# Altium schematic sheet 录音（ISD4004）.SchDoc
size A4
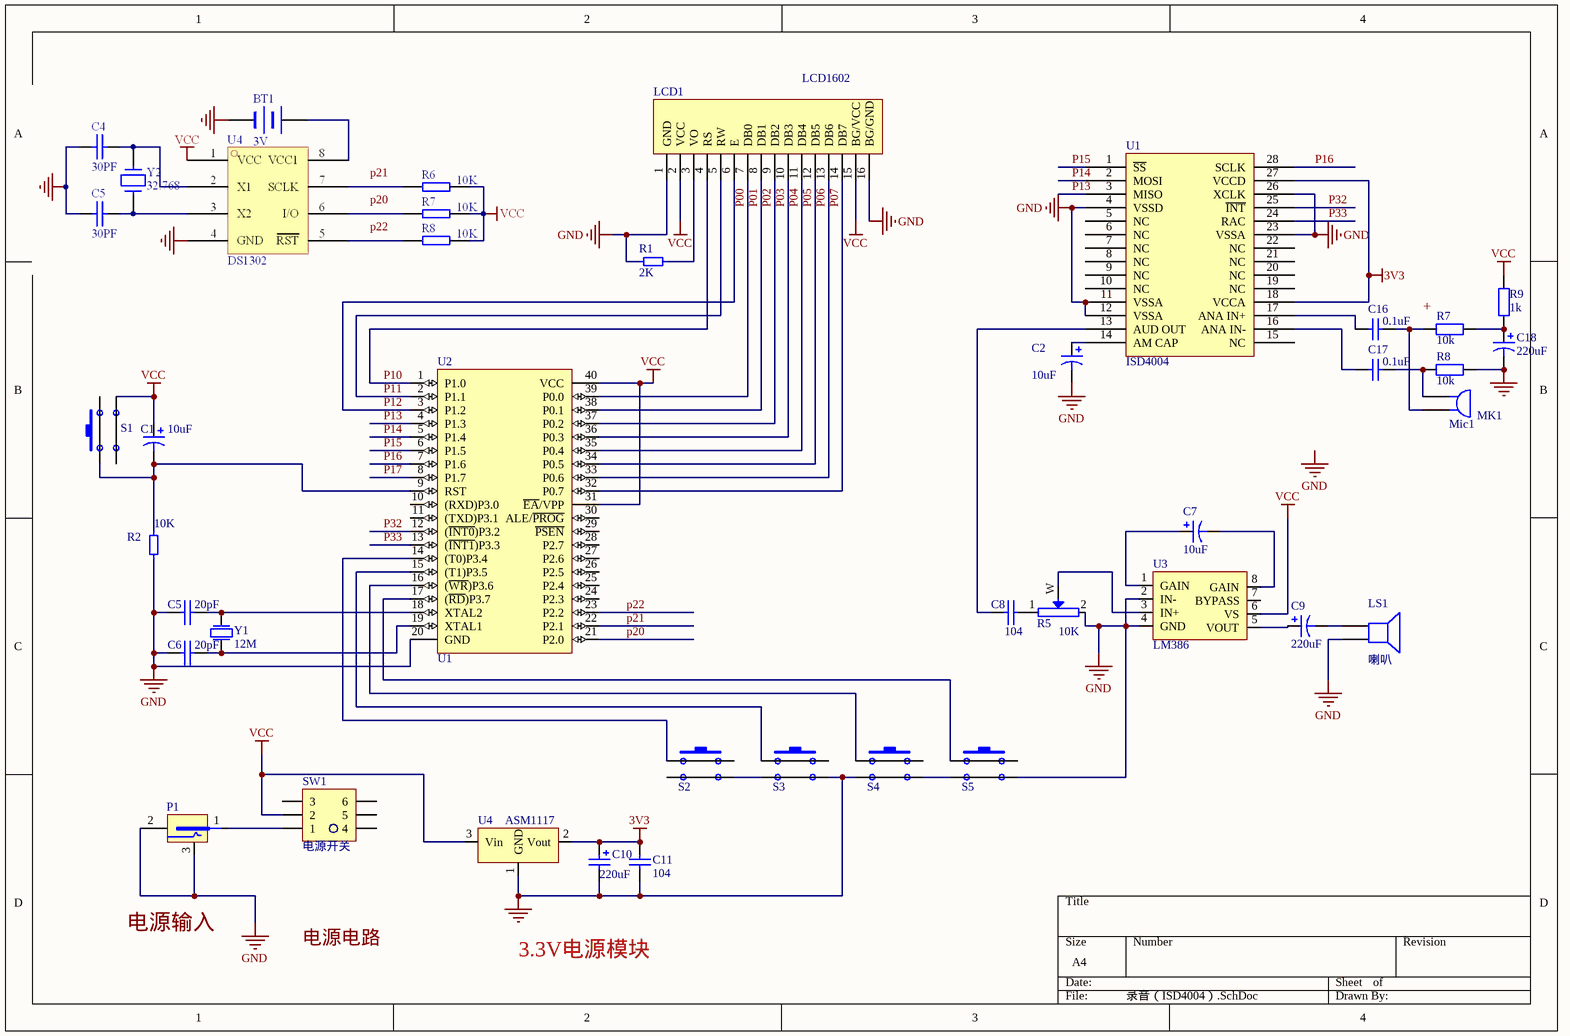
[diagram p0: 录音（ISD4004）.SchDoc]

## Parts
C1  10uF  [C_10]
C2  10uF  [C_10]
C5  20pF  [CAP CP]
C6  20pF  [CAP CP]
C7  10uF  [CAP_470]
C8  104  [CAP5]
C9  220uF  [CAP_470]
C10  220uf  [C_10]
C11  104  [CAP CP]
C16  0.1uF  [瓷片电容0.3]
C17  0.1uF  [瓷片电容0.3]
C18  220uF  [电容0.5]
LCD1  LCD1602  [1602]
LS1  喇叭  [SIP2]
MK1  Mic1  [PIN2]
P1  电源输入  [DC2.1]  (value not drawn)
R1  2K  [AXIAL0.3]
R2  10K  [AXIAL0.3]
R5  value 10K  [RES]  (hidden comment: RES  KB)
R7  10k  [AXIAL-0.4]
R8  10k  [AXIAL-0.4]
R9  1k  [AXIAL-0.4]
S1  SW  [key]  (value not drawn)
S2  SW  [key]  (value not drawn)
S3  SW  [key]  (value not drawn)
S4  SW  [key]  (value not drawn)
S5  SW  [key]  (value not drawn)
SW1  电源开关  [sw_自锁 1]
U1  ISD4004  [DIP28]
U2  U1  [DIP40 - 做板]
U3  LM386  [DIP8]
U4  ASM1117  [ASM1117]
Y1  12M  [XTAL]

## Nets
3V3: C10.1 C11.2 U1.18(VCCA) U1.27(VCCD) U4.2(Vout)
GND: C2.2 C5.1 C6.1 C10.2 C11.1 C18.2 LCD1.1(GND) LCD1.16(BG/GND) LS1.2 P1.2 P1.3 R1.1 R2.1 R5.2 R8.2 S3.2 S4.2 S5.2 U1.4(VSSD) U1.11(VSSA) U1.12(VSSA) U1.23(VSSA) U1.26(XCLK) U2.20(GND) U3.2(IN-) U3.4(GND) U4.1(GND)
VCC: C1.1 LCD1.2(VCC) LCD1.15(BG/VCC) R9.2 S1.2 SW1.2 U2.31(~{EA}/VPP) U2.40(VCC) U3.6(VS) U4.3(Vin)
P00: LCD1.7(DB0) U2.39(P0.0)
P01: LCD1.8(DB1) U2.38(P0.1)
P02: LCD1.9(DB2) U2.37(P0.2)
P03: LCD1.10(DB3) U2.36(P0.3)
P04: LCD1.11(DB4) U2.35(P0.4)
P05: LCD1.12(DB5) U2.34(P0.5)
P06: LCD1.13(DB6) U2.33(P0.6)
P07: LCD1.14(DB7) U2.32(P0.7)
P10: LCD1.4(RS) U2.1(P1.0)
P11: LCD1.5(RW) U2.2(P1.1)
P12: LCD1.6(E) U2.3(P1.2)
P13: U1.3(MISO) U2.4(P1.3)
P14: U1.2(MOSI) U2.5(P1.4)
P15: U1.1(~{SS}) U2.6(P1.5)
P16: U1.28(SCLK) U2.7(P1.6)
P17: U2.8(P1.7)
p20: U2.21(P2.0)
p21: U2.22(P2.1)
p22: U2.23(P2.2)
P32: U1.25(~{INT}) U2.12((~{INT0})P3.2)
P33: U1.24(RAC) U2.13((~{INT1})P3.3)
NetC1_2: C1.2 R2.2 S1.1 U2.9(RST)
NetC2_1: C2.1 U1.14(AM_CAP)
NetC5_2: C5.2 U2.18(XTAL2) Y1.1(P1)
NetC6_2: C6.2 U2.19(XTAL1) Y1.2(P2)
NetC7_1: C7.1 U3.1(GAIN)
NetC7_2: C7.2 U3.8(GAIN)
NetC8_1: C8.1 U1.13(AUD_OUT)
NetC8_2: C8.2 R5.1
NetC9_1: C9.1 U3.5(VOUT)
NetC9_2: C9.2 LS1.1
NetC16_1: C16.1 U1.17(ANA_IN+)
NetC16_2: C16.2 MK1.2 R7.1
NetC17_1: C17.1 U1.16(ANA_IN-)
NetC17_2: C17.2 MK1.1 R8.1
NetC18_1: C18.1 R7.2 R9.1
NetLCD1_3: LCD1.3(VO) R1.2
NetP1_1: P1.1 SW1.1
NetR5_W: R5.W U3.3(IN+)
NetS2_1: S2.1 U2.14((T0)P3.4)
NetS2_2: S2.2 S3.2
NetS3_1: S3.1 U2.15((T1)P3.5)
NetS4_1: S4.1 U2.16((~{WR})P3.6)
NetS4_2: S4.2 S5.2
NetS5_1: S5.1 U2.17((~{RD})P3.7)

Not connected (* = marked no-connect by the designer): SW1 3 4 5 6; U1 5(NC) 6(NC) 7(NC) 8(NC) 9(NC) 10(NC) 15(NC) 19(NC) 20(NC) 21(NC) 22(NC); U2 10((RXD)P3.0) 11((TXD)P3.1) 24(P2.3) 25(P2.4) 26(P2.5) 27(P2.6) 28(P2.7) 29(~{PSEN}) 30(ALE/~{PROG}); U3 7(BYPASS)

## Notes on the sheet
- 3.3V电源模块
- Labels drawn without touching a wire or pin: +, GND, p20, p21, p22, 电源电路, 电源输入

## Library data of the parts
C1 C2 C7 C9 C18 = Cap Pol1: Polarized Capacitor (Radial); Published: 8-Jun-2000; LatestRevisionDate: 17-Jul-2002; LatestRevisionNote: Re-released for DXP Platform.; Publisher: Altium Limited
  C1 C2 C7 C9: PackageReference: RB7.6-15
C5 C6 C8 = CAP: 电容
C10 = CAP 470uF: 220uF 470uF 外径8mm 引脚3mm; value: 220uF
C11 = CAP: 瓷片电容; value: 103
C16 C17 = Cap: Capacitor; Published: 8-Jun-2000; LatestRevisionDate: 17-Jul-2002; LatestRevisionNote: Re-released for DXP Platform.; Publisher: Altium Limited
LS1 = Speaker: Loudspeaker; Published: 24-Mar-1999; LatestRevisionDate: 17-Jul-2002; LatestRevisionNote: Re-released for DXP Platform.; PackageReference: PIN2; Publisher: Altium Limited
MK1 = Mic1: Microphone; Published: 24-Mar-1999; LatestRevisionDate: 17-Jul-2002; LatestRevisionNote: Re-released for DXP Platform.; Publisher: Altium Limited
P1 = POWER
R1 R2 = RES2
R5 = RES  KB: 可调电位器
R7-R9 = Res2: Resistor; Published: 8-Jun-2000; LatestRevisionDate: 17-Jul-2002; LatestRevisionNote: Re-released for DXP Platform.; Publisher: Altium Limited
S1-S5 = SW1_key
SW1 = SW1
Y1 = 16M: Crystal Oscillator